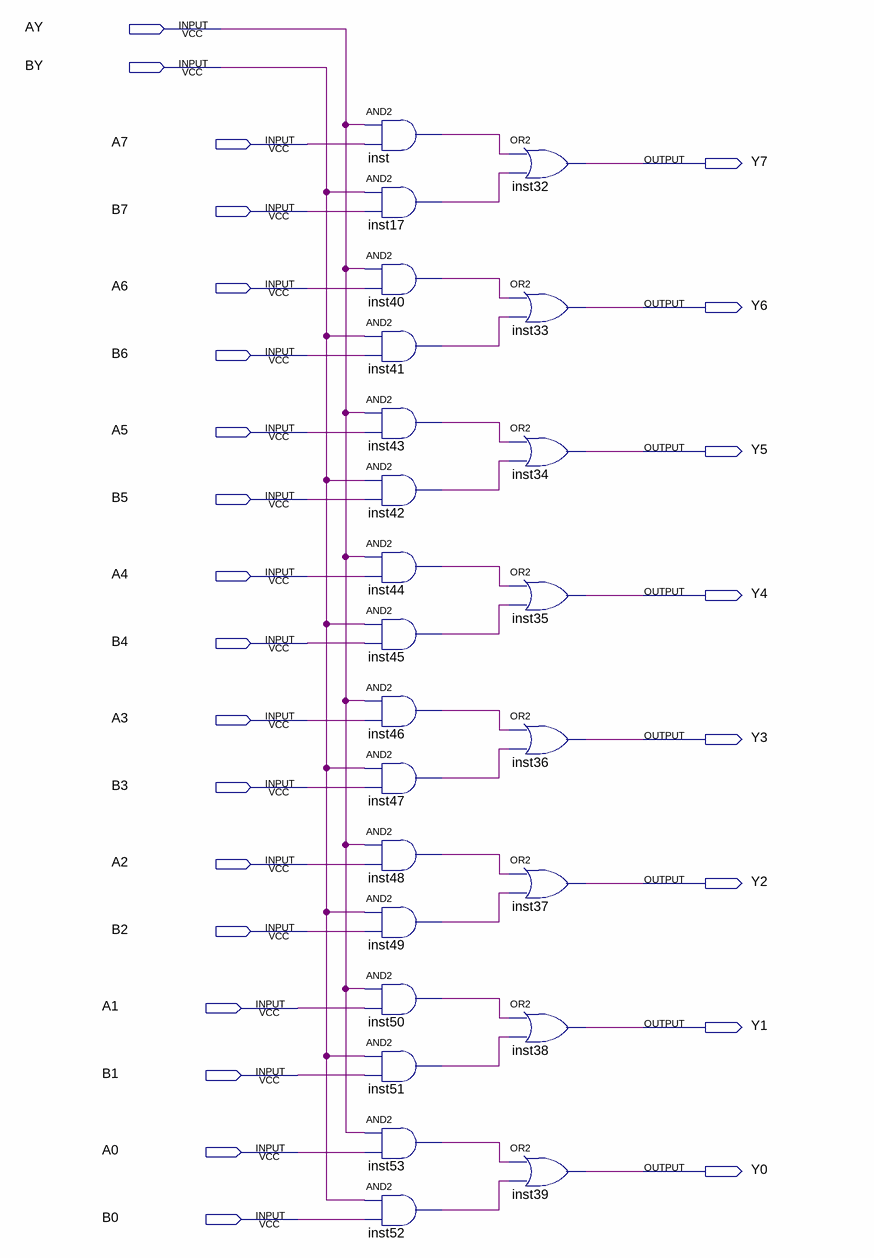
[diagram p0: schematic sheet]
// Quartus schematic My_8_bit_double_plexer.bdf as structural Verilog: 24 symbols, 26 pins
module My_8_bit_double_plexer (
  input  AY,
  input  BY,
  input  A7,
  input  B7,
  input  A6,
  input  B6,
  input  A5,
  input  B5,
  input  A4,
  input  B4,
  input  A3,
  input  B3,
  input  A2,
  input  B2,
  input  A1,
  input  B1,
  input  A0,
  input  B0,
  output Y7,
  output Y6,
  output Y5,
  output Y4,
  output Y3,
  output Y2,
  output Y1,
  output Y0
);

  wire inst17_out, inst40_out, inst41_out, inst42_out, inst43_out, inst44_out, inst45_out, inst46_out,
       inst47_out, inst48_out, inst49_out, inst50_out, inst51_out, inst52_out, inst53_out, inst_out;

  and inst (inst_out, AY, A7);
  and inst17 (inst17_out, BY, B7);
  and inst40 (inst40_out, AY, A6);
  and inst41 (inst41_out, BY, B6);
  and inst43 (inst43_out, AY, A5);
  and inst42 (inst42_out, BY, B5);
  and inst44 (inst44_out, AY, A4);
  and inst45 (inst45_out, BY, B4);
  and inst46 (inst46_out, AY, A3);
  and inst47 (inst47_out, BY, B3);
  and inst48 (inst48_out, AY, A2);
  and inst49 (inst49_out, BY, B2);
  and inst50 (inst50_out, AY, A1);
  and inst51 (inst51_out, BY, B1);
  and inst53 (inst53_out, AY, A0);
  and inst52 (inst52_out, BY, B0);
  or inst32 (Y7, inst_out, inst17_out);
  or inst33 (Y6, inst40_out, inst41_out);
  or inst34 (Y5, inst43_out, inst42_out);
  or inst35 (Y4, inst44_out, inst45_out);
  or inst36 (Y3, inst46_out, inst47_out);
  or inst37 (Y2, inst48_out, inst49_out);
  or inst38 (Y1, inst50_out, inst51_out);
  or inst39 (Y0, inst53_out, inst52_out);
endmodule
